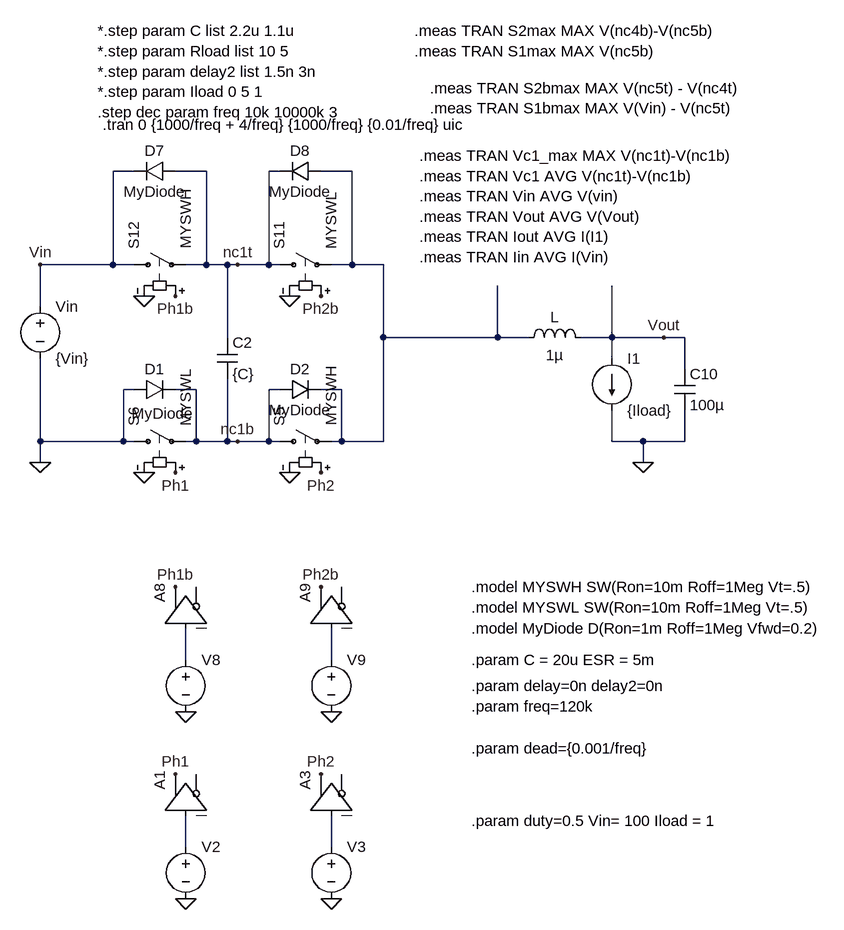
[diagram p0: schematic 3level_impedance.asc]
3level_impedance.asc, the LTspice schematic file:
Version 4
SHEET 1 1904 1428
WIRE -1152 -64 -1184 -64
WIRE -1040 -64 -1088 -64
WIRE -928 -64 -944 -64
WIRE -816 -64 -864 -64
WIRE -1184 80 -1184 -64
WIRE -1184 80 -1296 80
WIRE -1152 80 -1184 80
WIRE -1040 80 -1040 -64
WIRE -1040 80 -1072 80
WIRE -1008 80 -1040 80
WIRE -992 80 -1008 80
WIRE -944 80 -944 -64
WIRE -944 80 -992 80
WIRE -928 80 -944 80
WIRE -816 80 -816 -64
WIRE -816 80 -848 80
WIRE -768 80 -816 80
WIRE -1296 144 -1296 80
WIRE -1008 192 -1008 80
WIRE -768 192 -768 80
WIRE -592 192 -592 112
WIRE -592 192 -768 192
WIRE -544 192 -592 192
WIRE -416 192 -416 112
WIRE -416 192 -464 192
WIRE -336 192 -416 192
WIRE -304 192 -336 192
WIRE -416 224 -416 192
WIRE -304 240 -304 192
WIRE -1152 272 -1168 272
WIRE -1056 272 -1088 272
WIRE -928 272 -944 272
WIRE -832 272 -864 272
WIRE -1296 352 -1296 224
WIRE -1168 352 -1168 272
WIRE -1168 352 -1296 352
WIRE -1152 352 -1168 352
WIRE -1056 352 -1056 272
WIRE -1056 352 -1072 352
WIRE -1008 352 -1008 256
WIRE -1008 352 -1056 352
WIRE -992 352 -1008 352
WIRE -944 352 -944 272
WIRE -944 352 -992 352
WIRE -928 352 -944 352
WIRE -832 352 -832 272
WIRE -832 352 -848 352
WIRE -768 352 -768 192
WIRE -768 352 -832 352
WIRE -416 352 -416 304
WIRE -368 352 -416 352
WIRE -304 352 -304 304
WIRE -304 352 -368 352
WIRE -1296 384 -1296 352
WIRE -368 384 -368 352
WIRE -1072 688 -1072 640
WIRE -848 688 -848 640
WIRE -1072 976 -1072 928
WIRE -848 976 -848 928
FLAG -1072 1056 0
FLAG -1088 864 Ph1
FLAG -1296 80 Vin
FLAG -864 128 Ph2b
FLAG -1088 128 Ph1b
FLAG -1136 128 0
FLAG -912 128 0
FLAG -848 1056 0
FLAG -864 864 Ph2
FLAG -864 400 Ph2
FLAG -1088 400 Ph1
FLAG -1136 400 0
FLAG -912 400 0
FLAG -368 384 0
FLAG -1296 384 0
FLAG -1072 768 0
FLAG -1088 576 Ph1b
FLAG -848 768 0
FLAG -864 576 Ph2b
FLAG -992 80 nc1t
FLAG -992 352 nc1b
FLAG -336 192 Vout
SYMBOL voltage -1072 960 R0
WINDOW 123 0 0 Left 2
WINDOW 39 0 0 Left 2
WINDOW 3 24 96 Invisible 2
SYMATTR Value PULSE(0 1 0 1p 1p {1/freq*(1-duty)} {1/freq})
SYMATTR InstName V2
SYMBOL Digital\\buf -1136 928 R270
SYMATTR InstName A1
SYMBOL voltage -1296 128 R0
WINDOW 123 0 0 Left 2
WINDOW 39 0 0 Left 2
SYMATTR InstName Vin
SYMATTR Value {Vin}
SYMBOL sw -944 80 R270
SYMATTR InstName S11
SYMATTR Value MYSWL
SYMBOL sw -1168 80 R270
SYMATTR InstName S12
SYMATTR Value MYSWH
SYMBOL voltage -848 960 R0
WINDOW 123 0 0 Left 2
WINDOW 39 0 0 Left 2
WINDOW 3 24 96 Invisible 2
SYMATTR Value PULSE(0 1 {1/freq/2+delay} 1p 1p {1/freq*(1-duty)-delay+delay2} {1/freq})
SYMATTR InstName V3
SYMBOL Digital\\buf -912 928 R270
SYMATTR InstName A3
SYMBOL sw -944 352 R270
SYMATTR InstName S5
SYMATTR Value MYSWH
SYMBOL sw -1168 352 R270
SYMATTR InstName S6
SYMATTR Value MYSWL
SYMBOL cap -1024 192 R0
SYMATTR InstName C2
SYMATTR Value {C}
SYMATTR SpiceLine Rser={ESR}
SYMATTR SpiceLine2 IC={Vin/2}
SYMBOL ind -560 208 R270
WINDOW 0 32 56 VTop 2
WINDOW 3 5 56 VBottom 2
SYMATTR InstName L
SYMATTR Value 1µ
SYMATTR SpiceLine Rser=1m
SYMATTR SpiceLine2 ic = {Iload}
SYMBOL cap -320 240 R0
SYMATTR InstName C10
SYMATTR Value 100µ
SYMATTR SpiceLine IC={Vin*duty}
SYMATTR SpiceLine2 Rser=1m
SYMBOL voltage -1072 672 R0
WINDOW 123 0 0 Left 2
WINDOW 39 0 0 Left 2
WINDOW 3 24 96 Invisible 2
SYMATTR Value PULSE(0 1 {1/freq*(1-duty)+dead+delay} 1p 1p {1/freq*duty-dead*2-delay+delay2} {1/freq})
SYMATTR InstName V8
SYMBOL Digital\\buf -1136 640 R270
SYMATTR InstName A8
SYMBOL voltage -848 672 R0
WINDOW 123 0 0 Left 2
WINDOW 39 0 0 Left 2
WINDOW 3 24 96 Invisible 2
SYMATTR Value PULSE(0 1 {1/freq/2+1/freq*(1-duty)+dead} 1p 1p {1/freq*duty-dead*2} {1/freq})
SYMATTR InstName V9
SYMBOL Digital\\buf -912 640 R270
SYMATTR InstName A9
SYMBOL diode -1152 288 R270
WINDOW 0 32 32 VTop 2
WINDOW 3 -5 44 VBottom 2
SYMATTR InstName D1
SYMATTR Value MyDiode
SYMBOL diode -928 288 R270
WINDOW 0 32 32 VTop 2
WINDOW 3 0 32 VBottom 2
SYMATTR InstName D2
SYMATTR Value MyDiode
SYMBOL diode -1088 -80 R90
WINDOW 0 0 32 VBottom 2
WINDOW 3 32 32 VTop 2
SYMATTR InstName D7
SYMATTR Value MyDiode
SYMBOL diode -864 -80 R90
WINDOW 0 0 32 VBottom 2
WINDOW 3 32 32 VTop 2
SYMATTR InstName D8
SYMATTR Value MyDiode
SYMBOL current -416 224 R0
WINDOW 123 0 0 Left 2
WINDOW 39 0 0 Left 2
SYMATTR InstName I1
SYMATTR Value {Iload}
TEXT -1200 -136 Left 2 !.tran 0 {1000/freq + 4/freq} {1000/freq} {0.01/freq} uic
TEXT -632 576 Left 2 !.model MYSWH SW(Ron=10m Roff=1Meg Vt=.5)\n.model MYSWL SW(Ron=10m Roff=1Meg Vt=.5)
TEXT -632 640 Left 2 !.model MyDiode D(Ron=1m Roff=1Meg Vfwd=0.2)
TEXT -632 728 Left 2 !.param delay=0n delay2=0n
TEXT -632 760 Left 2 !.param freq=120k
TEXT -632 936 Left 2 !.param duty=0.5 Vin= 100 Iload = 1
TEXT -632 824 Left 2 !.param dead={0.001/freq}
TEXT -632 688 Left 2 !.param C = 20u ESR = 5m
TEXT -720 -280 Left 2 !.meas TRAN S2max MAX V(nc4b)-V(nc5b)\n.meas TRAN S1max MAX V(nc5b)
TEXT -712 -88 Left 2 !.meas TRAN Vc1_max MAX V(nc1t)-V(nc1b)\n.meas TRAN Vc1 AVG V(nc1t)-V(nc1b)\n.meas TRAN Vin AVG V(vin)\n.meas TRAN Vout AVG V(Vout)\n.meas TRAN Iout AVG I(I1)\n.meas TRAN Iin AVG I(Vin)
TEXT -696 -192 Left 2 !.meas TRAN S2bmax MAX V(nc5t) - V(nc4t)\n.meas TRAN S1bmax MAX V(Vin) - V(nc5t)
TEXT -1208 -280 Left 2 !*.step param C list 2.2u 1.1u\n*.step param Rload list 10 5\n*.step param delay2 list 1.5n 3n\n*.step param Iload 0 5 1\n.step dec param freq 10k 10000k 3

The netlist it stands for:
* 3level_impedance.asc
V2 N004 0 PULSE(0 1 0 1p 1p {1/freq*(1-duty)} {1/freq})
A1 N004 0 0 0 0 0 Ph1 0 BUF
Vin Vin 0 {Vin}
S11 nc1t N001 Ph2b 0 MYSWL
S12 Vin nc1t Ph1b 0 MYSWH
V3 N005 0 PULSE(0 1 {1/freq/2+delay} 1p 1p {1/freq*(1-duty)-delay+delay2} {1/freq})
A3 N005 0 0 0 0 0 Ph2 0 BUF
S5 nc1b N001 Ph2 0 MYSWH
S6 0 nc1b Ph1 0 MYSWL
C2 nc1t nc1b {C} Rser={ESR} IC={Vin/2}
L N001 Vout 1µ Rser=1m ic = {Iload}
C10 Vout 0 100µ IC={Vin*duty} Rser=1m
V8 N002 0 PULSE(0 1 {1/freq*(1-duty)+dead+delay} 1p 1p {1/freq*duty-dead*2-delay+delay2} {1/freq})
A8 N002 0 0 0 0 0 Ph1b 0 BUF
V9 N003 0 PULSE(0 1 {1/freq/2+1/freq*(1-duty)+dead} 1p 1p {1/freq*duty-dead*2} {1/freq})
A9 N003 0 0 0 0 0 Ph2b 0 BUF
D1 0 nc1b MyDiode
D2 nc1b N001 MyDiode
D7 nc1t Vin MyDiode
D8 N001 nc1t MyDiode
I1 Vout 0 {Iload}
.model D D
.lib standard.dio
.tran 0 {1000/freq + 4/freq} {1000/freq} {0.01/freq} uic
.model MYSWH SW(Ron=10m Roff=1Meg Vt=.5)
.model MYSWL SW(Ron=10m Roff=1Meg Vt=.5)
.model MyDiode D(Ron=1m Roff=1Meg Vfwd=0.2)
.param delay=0n delay2=0n
.param freq=120k
.param duty=0.5 Vin= 100 Iload = 1
.param dead={0.001/freq}
.param C = 20u ESR = 5m
.meas TRAN S2max MAX V(nc4b)-V(nc5b)
.meas TRAN S1max MAX V(nc5b)
.meas TRAN Vc1_max MAX V(nc1t)-V(nc1b)
.meas TRAN Vc1 AVG V(nc1t)-V(nc1b)
.meas TRAN Vin AVG V(vin)
.meas TRAN Vout AVG V(Vout)
.meas TRAN Iout AVG I(I1)
.meas TRAN Iin AVG I(Vin)
.meas TRAN S2bmax MAX V(nc5t) - V(nc4t)
.meas TRAN S1bmax MAX V(Vin) - V(nc5t)
*.step param C list 2.2u 1.1u
*.step param Rload list 10 5
*.step param delay2 list 1.5n 3n
*.step param Iload 0 5 1
.step dec param freq 10k 10000k 3
.backanno
.end